# EAGLE design umodular_mega_shield_rev01 (EAGLE 7.2.0)
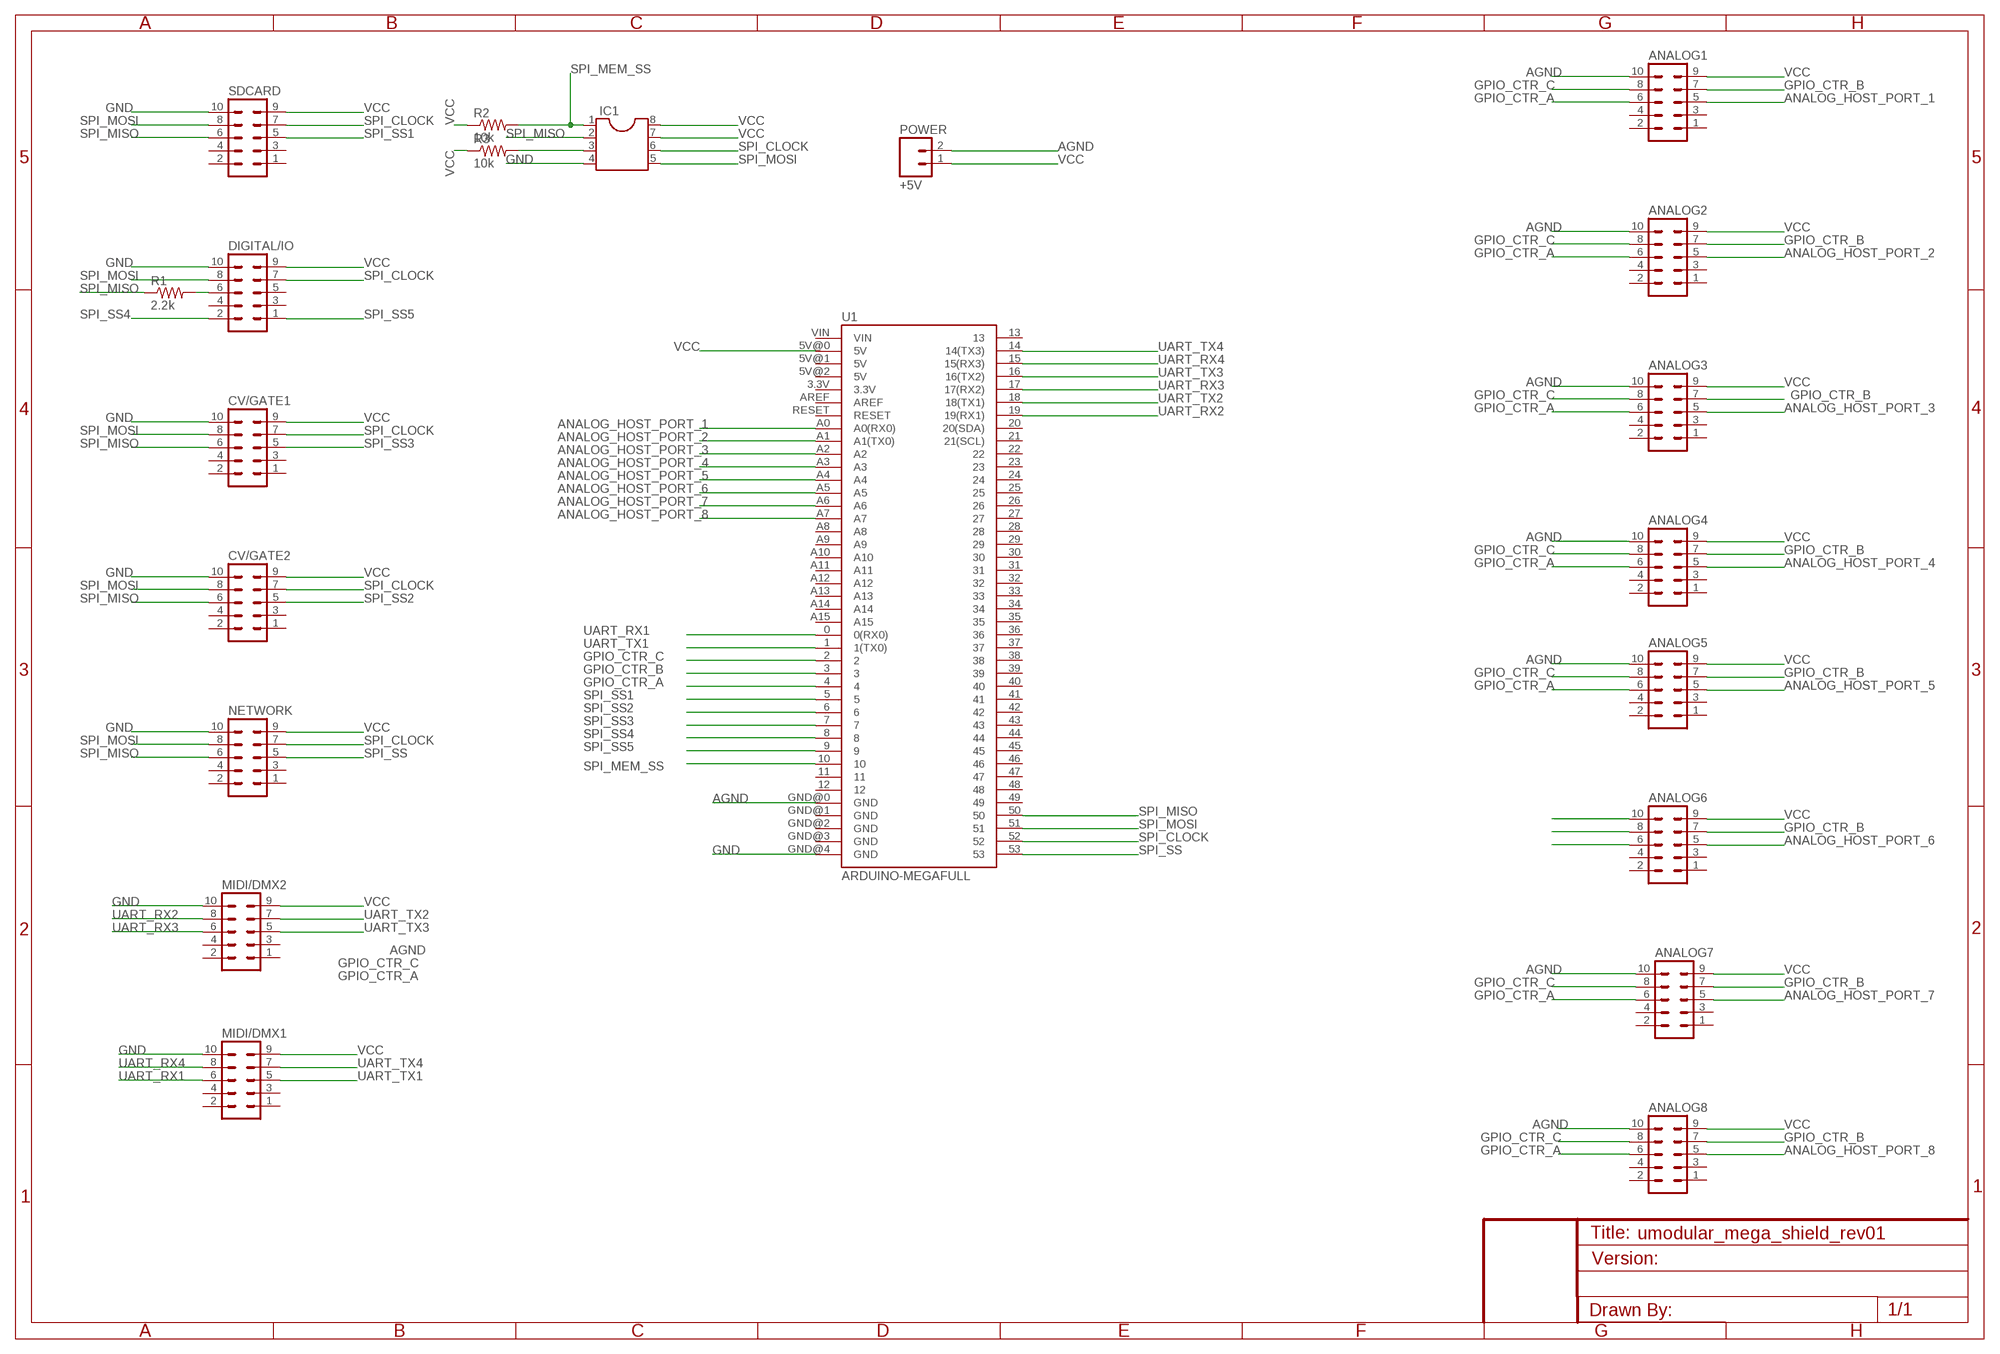
[diagram p0: schematic, sheet 1]

## Parts
ANALOG1  MA05-2  [MA05-2]
ANALOG2  MA05-2  [MA05-2]
ANALOG3  MA05-2  [MA05-2]
ANALOG4  MA05-2  [MA05-2]
ANALOG5  MA05-2  [MA05-2]
ANALOG6  MA05-2  [MA05-2]
ANALOG7  MA05-2  [MA05-2]
ANALOG8  MA05-2  [MA05-2]
CV/GATE1  MA05-2  [MA05-2]
CV/GATE2  MA05-2  [MA05-2]
DIGITAL/IO  MA05-2  [MA05-2]
IC1  DIL8  [DIL08]
MIDI/DMX1  MA05-2  [MA05-2]
MIDI/DMX2  MA05-2  [MA05-2]
NETWORK  MA05-2  [MA05-2]
POWER  +5V  M02LOCK_LONGPADS  [1X02_LOCK_LONGPADS]
R1  2.2k  R-US_0204/7  [0204/7]
R2  10k  R-US_0204/7  [0204/7]
R3  10k  R-US_0204/7  [0204/7]
SDCARD  MA05-2  [MA05-2]
U1  ARDUINO-MEGAFULL  [ARDUINO_MEGA]

## Nets
AGND: ANALOG1.10 ANALOG2.10 ANALOG3.10 ANALOG4.10 ANALOG5.10 ANALOG6.10 ANALOG7.10 ANALOG8.10 POWER.2 U1.GND@0(GND)
ANALOG_HOST_PORT_1: ANALOG1.5 U1.A0(A0(RX0))
ANALOG_HOST_PORT_2: ANALOG2.5 U1.A1(A1(TX0))
ANALOG_HOST_PORT_3: ANALOG3.5 U1.A2
ANALOG_HOST_PORT_4: ANALOG4.5 U1.A3
ANALOG_HOST_PORT_5: ANALOG5.5 U1.A4
ANALOG_HOST_PORT_6: ANALOG6.5 U1.A5
ANALOG_HOST_PORT_7: ANALOG7.5 U1.A6
ANALOG_HOST_PORT_8: ANALOG8.5 U1.A7
GND: CV/GATE1.10 CV/GATE2.10 DIGITAL/IO.10 IC1.4 MIDI/DMX1.10 MIDI/DMX2.10 NETWORK.10 SDCARD.10 U1.GND@4(GND)
GPIO_CTR_A: ANALOG1.6 ANALOG2.6 ANALOG3.6 ANALOG4.6 ANALOG5.6 ANALOG6.6 ANALOG7.6 ANALOG8.6 U1.4
GPIO_CTR_B: ANALOG1.7 ANALOG2.7 ANALOG3.7 ANALOG4.7 ANALOG5.7 ANALOG6.7 ANALOG7.7 ANALOG8.7 U1.3
GPIO_CTR_C: ANALOG1.8 ANALOG2.8 ANALOG3.8 ANALOG4.8 ANALOG5.8 ANALOG6.8 ANALOG7.8 ANALOG8.8 U1.2
N$1: DIGITAL/IO.6 R1.2
N$4: IC1.3 R3.2
SPI_CLOCK: CV/GATE1.7 CV/GATE2.7 DIGITAL/IO.7 IC1.6 NETWORK.7 SDCARD.7 U1.52
SPI_MEM_SS: IC1.1 R2.2 U1.10
SPI_MISO: CV/GATE1.6 CV/GATE2.6 IC1.2 NETWORK.6 R1.1 SDCARD.6 U1.50
SPI_MOSI: CV/GATE1.8 CV/GATE2.8 DIGITAL/IO.8 IC1.5 NETWORK.8 SDCARD.8 U1.51
SPI_SS: NETWORK.5 U1.53
SPI_SS1: SDCARD.5 U1.5
SPI_SS2: CV/GATE2.5 U1.6
SPI_SS3: CV/GATE1.5 U1.7
SPI_SS4: DIGITAL/IO.2 U1.8
SPI_SS5: DIGITAL/IO.1 U1.9
UART_RX1: MIDI/DMX1.6 U1.0(0(RX0))
UART_RX2: MIDI/DMX2.8 U1.19(19(RX1))
UART_RX3: MIDI/DMX2.6 U1.17(17(RX2))
UART_RX4: MIDI/DMX1.8 U1.15(15(RX3))
UART_TX1: MIDI/DMX1.5 U1.1(1(TX0))
UART_TX2: MIDI/DMX2.7 U1.18(18(TX1))
UART_TX3: MIDI/DMX2.5 U1.16(16(TX2))
UART_TX4: MIDI/DMX1.7 U1.14(14(TX3))
VCC: ANALOG1.9 ANALOG2.9 ANALOG3.9 ANALOG4.9 ANALOG5.9 ANALOG6.9 ANALOG7.9 ANALOG8.9 CV/GATE1.9 CV/GATE2.9 DIGITAL/IO.9 IC1.7 IC1.8 MIDI/DMX1.9 MIDI/DMX2.9 NETWORK.9 POWER.1 R2.1 R3.1 SDCARD.9 U1.5V@0(5V)
Unconnected: ANALOG1.1 ANALOG1.2 ANALOG1.3 ANALOG1.4 ANALOG2.1 ANALOG2.2 ANALOG2.3 ANALOG2.4 ANALOG3.1 ANALOG3.2 ANALOG3.3 ANALOG3.4 ANALOG4.1 ANALOG4.2 ANALOG4.3 ANALOG4.4 ANALOG5.1 ANALOG5.2 ANALOG5.3 ANALOG5.4 ANALOG6.1 ANALOG6.2 ANALOG6.3 ANALOG6.4 ANALOG7.1 ANALOG7.2 ANALOG7.3 ANALOG7.4 ANALOG8.1 ANALOG8.2 ANALOG8.3 ANALOG8.4 CV/GATE1.1 CV/GATE1.2 CV/GATE1.3 CV/GATE1.4 CV/GATE2.1 CV/GATE2.2 CV/GATE2.3 CV/GATE2.4 DIGITAL/IO.3 DIGITAL/IO.4 DIGITAL/IO.5 MIDI/DMX1.1 MIDI/DMX1.2 MIDI/DMX1.3 MIDI/DMX1.4 MIDI/DMX2.1 MIDI/DMX2.2 MIDI/DMX2.3 MIDI/DMX2.4 NETWORK.1 NETWORK.2 NETWORK.3 NETWORK.4 SDCARD.1 SDCARD.2 SDCARD.3 SDCARD.4 U1.3.3V U1.5V@1(5V) U1.5V@2(5V) U1.11 U1.12 U1.13 U1.20(20(SDA)) U1.21(21(SCL)) U1.22 U1.23 U1.24 U1.25 U1.26 U1.27 U1.28 U1.29 U1.30 U1.31 U1.32 U1.33 U1.34 U1.35 U1.36 U1.37 U1.38 U1.39 U1.40 U1.41 U1.42 U1.43 U1.44 U1.45 U1.46 U1.47 U1.48 U1.49 U1.A8 U1.A9 U1.A10 U1.A11 U1.A12 U1.A13 U1.A14 U1.A15 U1.AREF U1.GND@1(GND) U1.GND@2(GND) U1.GND@3(GND) U1.RESET U1.VIN

## Library data of the parts
ANALOG1-ANALOG8 CV/GATE1 CV/GATE2 DIGITAL/IO MIDI/DMX1 MIDI/DMX2 NETWORK SDCARD = con-lstb:MA05-2: PIN HEADER; OC_FARNELL: unknown; OC_NEWARK: unknown
IC1 = ic-package:DIL8: Dual In Line / Socket
POWER = SparkFun-Connectors:M02: Standard 2-pin 0.1" header. Use with - straight break away headers ( PRT-00116) - right angle break away headers (PRT-00553) - swiss pins (PRT-00743) - machine pins (PRT-00117) - female headers (PRT-00115) Molex polarized connector foot print use with: PRT-08233 with associated crimp pins and housings. 2.54_SCREWTERM for use with PRT-10571. 3.5mm Screw Terminal footprints for PRT-08084 5mm Screw Terminal footprints for use with PRT-08433
R1-R3 = rcl:R-US_: RESISTOR, American symbol
U1 = SparkFun-Boards:ARDUINO-MEGA: Arduino Mega board footprint

## Net classes
0 default: width 0.254 mm

## Board
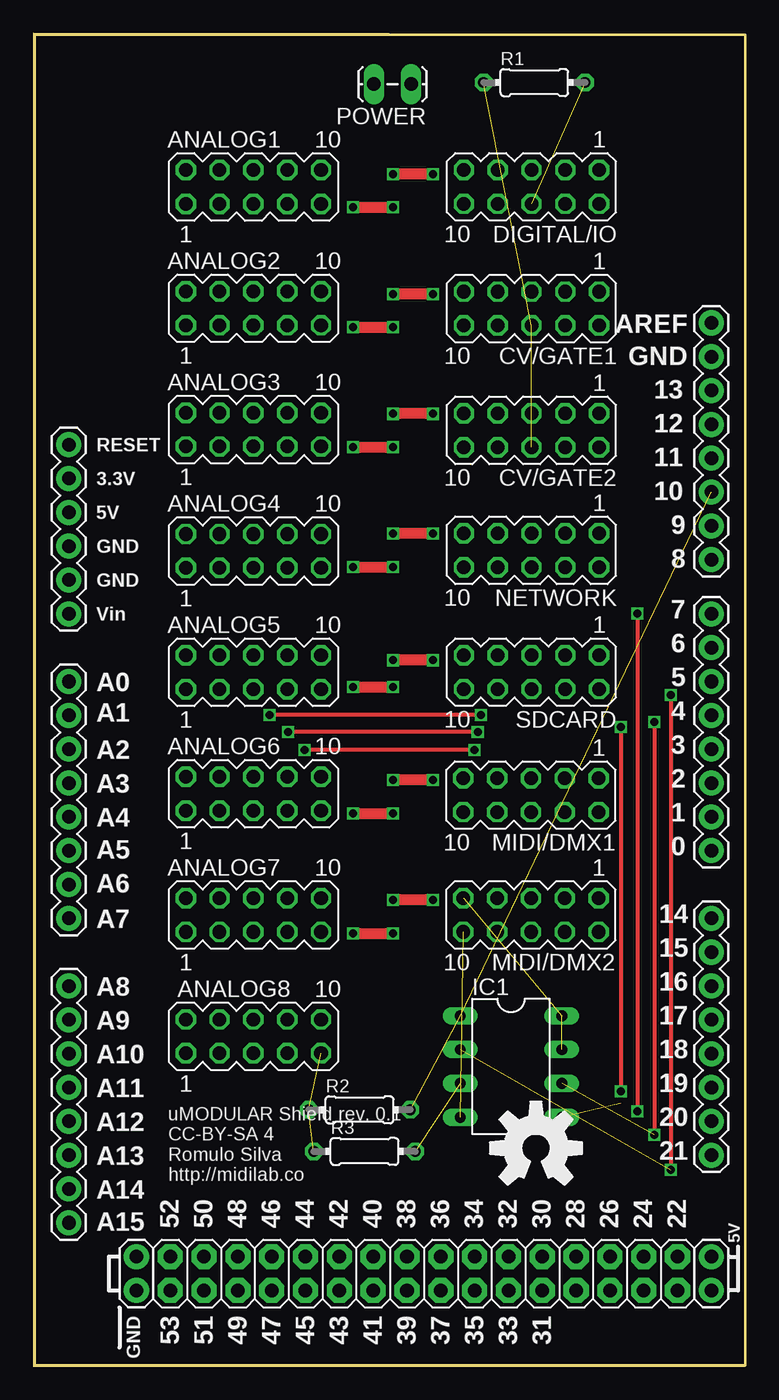
[diagram p1: board, top side]
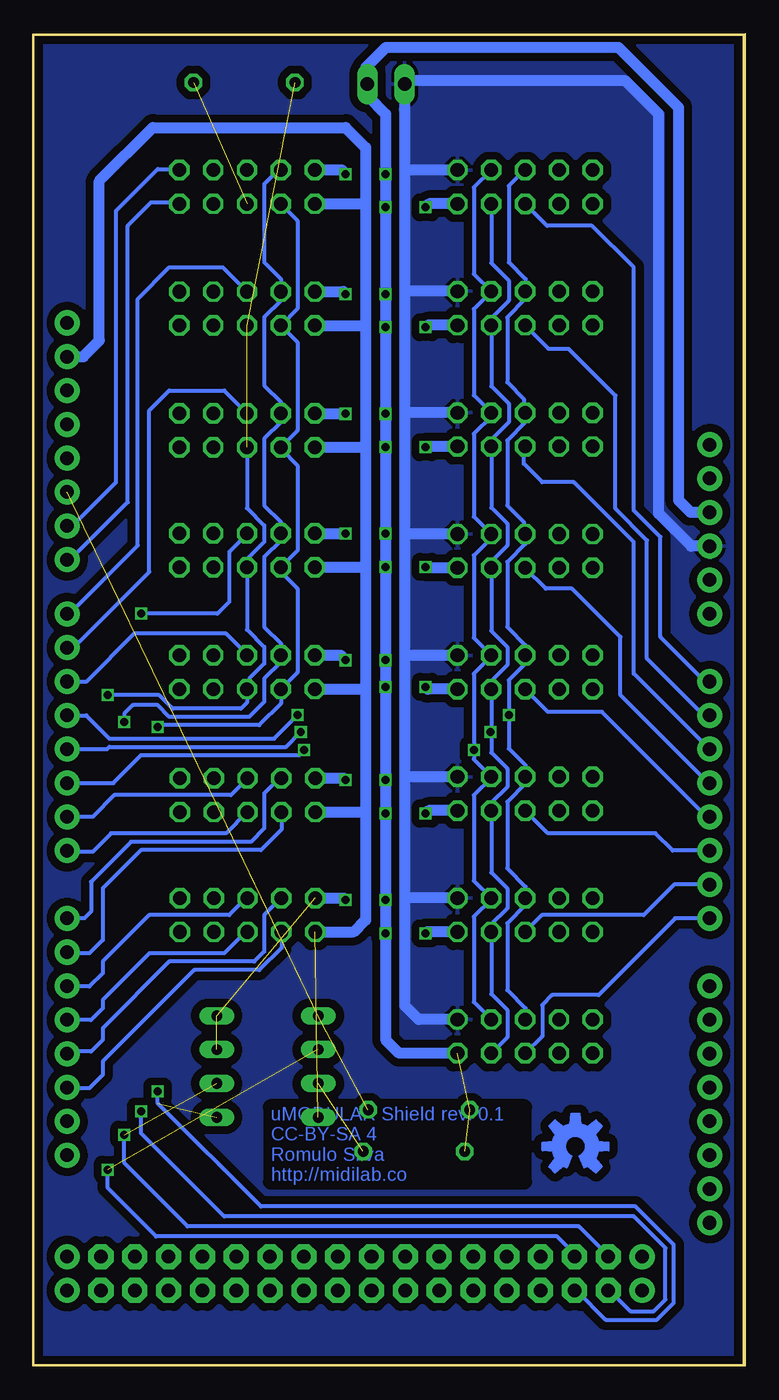
[diagram p2: board, bottom side, seen from below]

Size 53.47 x 100.07 mm. Coordinates in mm from the lower left corner, seen from the top.
Outline: 0,0 53.47,0 53.47,100 0,100.07 0,0
Copper layers (1*16): Top 0.035mm / dielectric 1.5mm / Bottom 0.035mm
Design rules "SeeedStudio_2layer_DRU_no_angle_20140221": minimum track width 6mil, minimum drill 12mil, track to track 6mil, track to pad 6mil, pad to pad 6mil, via to via 6mil, smd to smd 0mil, copper to edge 10mil, drill to drill 10mil, minimum pad ring 10mil, minimum via ring 6mil, stop-mask expansion 2mil, vias tented up to drill 100mil, thermal gap 10mil

### Footprints (pad centres in the part's own frame; a part is rotated, then mirrored left to right if it is on the bottom)
MA05-2 = drill 1.016 octagon: 1 -5.08,-1.27; 2 -5.08,1.27; 3 -2.54,-1.27; 4 -2.54,1.27; 5 0,-1.27; 6 0,1.27; 7 2.54,-1.27; 8 2.54,1.27; 9 5.08,-1.27; 10 5.08,1.27
DIL08 = drill 0.813 long: 1 -3.81,-3.81; 2 -1.27,-3.81; 3 1.27,-3.81; 4 3.81,-3.81; 5 3.81,3.81; 6 1.27,3.81; 7 -1.27,3.81; 8 -3.81,3.81
1X02_LOCK_LONGPADS = drill 1.016 long: 1 -0.127,0; 2 2.667,0
0204/7 = drill 0.813 octagon: 1 -3.81,0; 2 3.81,0
ARDUINO_MEGA = drill 1.016 pad 1.88: 0 61.42,50.8; 1 58.88,50.8; 2 56.34,50.8; 3 53.8,50.8; 3.3V 33.48,2.54; 4 51.26,50.8; 5 48.72,50.8; 5V@0 36.02,2.54; 5V@1 91.9,50.8; 5V@2 94.44,50.8; 6 46.18,50.8; 7 43.64,50.8; 8 39.576,50.8; 9 37.036,50.8; 10 34.496,50.8; 11 31.956,50.8; 12 29.416,50.8; 13 26.876,50.8; 14 66.5,50.8; 15 69.04,50.8; 16 71.58,50.8; 17 74.12,50.8; 18 76.66,50.8; 19 79.2,50.8; 20 81.74,50.8; 21 84.28,50.8; A0 48.72,2.54; A1 51.26,2.54; A2 53.8,2.54; A3 56.34,2.54; A4 58.88,2.54; A5 61.42,2.54; A6 63.96,2.54; A7 66.5,2.54; A8 71.58,2.54; A9 74.12,2.54; A10 76.66,2.54; A11 79.2,2.54; A12 81.74,2.54; A13 84.28,2.54; A14 86.82,2.54; A15 89.36,2.54; AREF 21.796,50.8; GND@0 38.56,2.54; GND@1 41.1,2.54; GND@2 91.9,7.62; GND@3 94.44,7.62; GND@4 24.336,50.8; RESET 30.94,2.54; VIN 43.64,2.54 | drill 1.016 pad 1.88 octagon: 22 91.9,48.26; 23 94.44,48.26; 24 91.9,45.72; 25 94.44,45.72; 26 91.9,43.18; 27 94.44,43.18; 28 91.9,40.64; 29 94.44,40.64; 30 91.9,38.1; 31 94.44,38.1; 32 91.9,35.56; 33 94.44,35.56; 34 91.9,33.02; 35 94.44,33.02; 36 91.9,30.48; 37 94.44,30.48; 38 91.9,27.94; 39 94.44,27.94; 40 91.9,25.4; 41 94.44,25.4; 42 91.9,22.86; 43 94.44,22.86; 44 91.9,20.32; 45 94.44,20.32; 46 91.9,17.78; 47 94.44,17.78; 48 91.9,15.24; 49 94.44,15.24; 50 91.9,12.7; 51 94.44,12.7; 52 91.9,10.16; 53 94.44,10.16

### Placement (x,y rotation side)
ANALOG1  16.53,88.53 0 top
ANALOG2  16.53,79.42 0 top
ANALOG3  16.53,70.31 0 top
ANALOG4  16.53,61.2 0 top
ANALOG5  16.53,52.09 0 top
ANALOG6  16.53,42.98 0 top
ANALOG7  16.53,33.88 0 top
ANALOG8  16.53,24.77 0 top
CV/GATE1  37.41,79.41 180 top
CV/GATE2  37.41,70.27 180 top
DIGITAL/IO  37.41,88.55 180 top
IC1  35.88,22.5 270 top
MIDI/DMX1  37.38,42.88 180 top
MIDI/DMX2  37.38,33.88 180 top
NETWORK  37.41,61.25 180 top
POWER  28.25,96.25 180 top
R1  37.62,96.38 0 top
R2  24.5,19.25 0 top
R3  24.88,16.12 0 top
SDCARD  37.41,52.11 180 top
U1  0.12,100.12 270 top
U$1  [OSHW-LOGO-M]  12.75,16.5 0 top
U$5  [OSHW-LOGO-L]  37.75,16.38 0 top

### Tracks (layer width: path | path; a pad name or v marks a point on that pad's centre or on a via)
AGND
  Bottom 0.813: U1.GND@0 4.07,61.56 6.5,64 6.5,94 9,96.5 25.33,96.5 POWER.2 25.58,90 | 25.58,90 25.58,80.5 | 25.58,80.5 25.58,71.5 | 25.58,71.5 25.58,62.5 | 25.58,62.5 25.58,53.5 | 25.58,53.5 25.58,44 | 25.58,44 25.58,35 | 25.58,35 25.58,27.08 24.54,26.04 ANALOG8.10 | ANALOG1.10 25.39,89.81 25.58,90 | ANALOG2.10 25.39,80.69 25.58,80.5 | ANALOG3.10 25.5,71.58 25.58,71.5 | ANALOG4.10 25.56,62.48 25.58,62.5 | ANALOG5.10 25.45,53.37 25.58,53.5 | ANALOG6.10 25.33,44.26 25.58,44 | ANALOG7.10 25.44,35.15 25.58,35
  pour Bottom (isolate 0.61): 0,100 53.5,100 53.5,-0.12 0,-0.12
ANALOG_HOST_PORT_1
  Bottom 0.305: U1.A0 3.03,51.41 6.38,54.75 6.38,62.25 8.38,64.25 8.38,82.5 11.5,85.62 14.89,85.62 ANALOG1.5
ANALOG_HOST_PORT_2
  Bottom 0.305: U1.A1 3.12,48.87 7.38,53.12 7.38,62 9.75,64.38 9.75,72.88 13.25,76.38 14.75,76.38 ANALOG2.5
ANALOG_HOST_PORT_3
  Bottom 0.305: U1.A2 2.7,46.33 8.38,52 8.38,61.88 12.88,66.38 15.25,66.38 16.62,67.75 16.62,68.95 ANALOG3.5
ANALOG_HOST_PORT_4
  Bottom 0.305: U1.A3 2.79,43.78 9.38,50.38 9.38,54.75 13,58.38 14.97,58.38 ANALOG4.5
ANALOG_HOST_PORT_5
  Bottom 0.305: U1.A4 2.87,41.24 10.75,49.12 14.83,49.12 ANALOG5.5
ANALOG_HOST_PORT_6
  Bottom 0.305: U1.A5 5.46,38.7 6.75,40 14.81,40 ANALOG6.5
ANALOG_HOST_PORT_7
  Bottom 0.305: U1.A6 5.33,36.16 7.62,33.88 15.26,33.88 ANALOG7.5
ANALOG_HOST_PORT_8
  Bottom 0.305: U1.A7 5.25,33.62 11,27.88 14.5,27.88 15.25,27.12 15.25,24.77 ANALOG8.5
GND  (1 unrouted)
  Bottom 0.813: U1.GND@4 49.71,75.79 48.5,77 48.5,89 44.5,93 30,93 28.5,91.5 28.5,87 | 28.5,87 28.5,78 | 28.5,78 28.5,69 | 28.5,69 28.5,60 | 28.5,60 28.5,51 | 28.5,51 28.5,41.5 | 28.5,41.5 28.5,33.5 29.39,32.6 MIDI/DMX2.10 | DIGITAL/IO.10 28.77,87.28 28.5,87 | CV/GATE1.10 28.64,78.14 28.5,78 | CV/GATE2.10 28.5,69 | NETWORK.10 28.52,59.98 28.5,60 | SDCARD.10 28.66,50.84 28.5,51 | MIDI/DMX1.10 28.61,41.6 28.5,41.5
GPIO_CTR_A  (via drill 0.6)
  Top 0.305: v33.62,48.88 v17.75,48.88
  Bottom 0.305: ANALOG1.6 16.57,89.81 17.75,88.62 17.75,82.88 16.5,81.62 16.5,80.72 ANALOG2.6 16.53,80.09 17.88,78.75 17.88,73.88 16.62,72.62 16.62,71.68 ANALOG3.6 16.53,70.84 17.88,69.5 17.88,64.62 16.62,63.38 16.62,62.57 ANALOG4.6 16.53,61.72 17.88,60.38 17.88,55.5 16.5,54.12 16.5,53.4 ANALOG5.6 16.53,52.72 17.75,51.5 17.75,48.62 | 17.75,48.62 17.75,46.38 16.5,45.12 16.5,44.28 ANALOG6.6 16.53,43.72 17.88,42.38 17.88,37.38 16.5,36 16.5,35.17 ANALOG7.6 16.53,34.59 17.88,33.25 17.88,28.25 16.5,26.88 16.5,26.07 ANALOG8.6 | U1.4 49.49,48.87 47.75,47.12 35.38,47.12 v33.62,48.88 | v17.75,48.88 18,48.88 17.75,48.62
GPIO_CTR_B  (via drill 0.6)
  Top 0.305: v33.38,47.62 v19.12,47.62
  Bottom 0.305: ANALOG1.7 19.07,82.82 17.75,81.5 17.75,80 19,78.75 19,78.22 ANALOG2.7 19.07,73.57 17.75,72.25 17.75,70.88 19.12,69.5 19.12,69.1 ANALOG3.7 19.07,64.44 17.88,63.25 17.88,61.62 19,60.5 19,60.01 ANALOG4.7 19.07,55.2 17.88,54 17.88,52.62 19,51.5 19,50.9 ANALOG5.7 19.07,47.75 | 19.07,47.75 19.07,46.07 17.88,44.88 17.88,43.5 19.12,42.25 19.12,41.77 ANALOG6.7 19.07,37.07 17.88,35.88 17.88,34.38 19.12,33.12 19.12,32.66 ANALOG7.7 19.07,27.95 17.88,26.75 17.88,24.69 ANALOG8.7 | U1.3 47.92,46.33 47.75,46.5 34.5,46.5 v33.38,47.62 | v19.12,47.62 19.2,47.62 19.07,47.75
GPIO_CTR_C  (via drill 0.6)
  Top 0.305: v33.12,46.25 v20.38,46.25
  Bottom 0.305: ANALOG1.8 20.38,88.5 20.38,82 ANALOG2.8 20.38,79.38 20.38,72.89 ANALOG3.8 19.07,71.31 20.38,70 20.38,63.78 ANALOG4.8 19.07,62.18 20.38,60.88 20.38,54.67 ANALOG5.8 19.07,53.3 20.38,52 20.38,46.12 | 20.38,46.12 20.38,45.56 ANALOG6.8 19.07,44.18 20.38,42.88 20.38,36.45 ANALOG7.8 19.07,35.05 20.38,33.75 20.38,27.34 ANALOG8.8 | U1.2 47.47,43.78 45.38,45.88 33.5,45.88 v33.12,46.25 | v20.38,46.25 20.5,46.25 20.38,46.12
N$1  (1 unrouted)
N$4  (1 unrouted)
SPI_CLOCK  (via drill 0.6)  (1 unrouted)
  Top 0.305: v46.62,48.38 v46.62,17.38
  Bottom 0.305: DIGITAL/IO.7 35.06,89.81 36.12,88.75 36.12,82.88 34.88,81.62 CV/GATE1.7 34.88,80 36.12,78.75 36.12,73.62 34.88,72.38 CV/GATE2.7 34.88,70.88 36.12,69.62 36.12,64.62 34.88,63.38 NETWORK.7 34.88,62 36.12,60.75 36.12,55.5 34.88,54.25 SDCARD.7 34.88,52.88 36.12,51.62 36.12,49.88 37.25,48.75 43.25,48.75 44.12,49.62 46,49.62 46.62,49 v46.62,48.38 | U1.52 10.29,8.29 12.5,10.5 41.88,10.5 46.62,15.25 v46.62,17.38
SPI_MEM_SS  (2 unrouted)
SPI_MISO  (via drill 0.6)  (3 unrouted)
  Top 0.305: v47.88,50.38 v47.88,14.75
  Bottom 0.305: CV/GATE2.6 37.41,64.42 36.12,63.12 36.12,61.88 37.38,60.62 37.38,60.02 NETWORK.6 37.41,55.29 36.12,54 36.12,52.75 37.25,51.62 37.25,51.01 SDCARD.6 37.41,49.84 37.88,49.38 43,49.38 44,50.38 v47.88,50.38 | U1.50 12.82,8.45 14.12,9.75 44.25,9.75 47.88,13.38 v47.88,14.75
SPI_MOSI  (via drill 0.6)  (1 unrouted)
  Top 0.305: v44.12,48 v44.12,20.62
  Bottom 0.305: DIGITAL/IO.8 34.88,87.25 33.62,86 33.62,79.39 CV/GATE1.8 34.88,78.12 33.62,76.88 33.62,70.25 CV/GATE2.8 34.88,68.88 33.62,67.62 33.62,61.23 NETWORK.8 34.88,59.62 33.62,58.38 33.62,52.09 SDCARD.8 34.88,49.75 36.5,48.12 43.88,48.12 v44.12,48 | U1.51 12.69,5.68 10.5,3.5 6.62,3.5 5.38,4.75 5.38,9.12 8.25,12 36.38,12 44.12,19.75 v44.12,20.62
SPI_SS  (via drill 0.6)
  Top 0.305: v45.38,56.5 v45.38,19.12
  Bottom 0.305: NETWORK.5 37.48,62.52 37.48,62.4 38.75,61.12 38.75,57.38 39.62,56.5 v45.38,56.5 | U1.53 10.19,5.68 8.62,4.12 6.88,4.12 6,5 6,8.88 8.38,11.25 39.12,11.25 45.38,17.5 v45.38,19.12
SPI_SS1
  Bottom 0.305: SDCARD.5 37.41,53.41 39,55 45.88,55 49.5,51.38 50.9,51.38 U1.5
SPI_SS2
  Bottom 0.305: U1.6 50.43,53.95 44.75,59.62 44.75,71.75 43.25,73.25 39.13,73.25 CV/GATE2.5
SPI_SS3
  Bottom 0.305: U1.7 50.77,56.48 45.62,61.62 45.62,80.12 43.25,82.5 39.24,82.5 CV/GATE1.5
SPI_SS4
  Bottom 0.305: U1.8 50.7,60.55 46.38,64.88 46.38,85.62 44.62,87.38 42.59,87.38 DIGITAL/IO.2
SPI_SS5
  Bottom 0.305: U1.9 50.54,63.09 47.25,66.38 47.25,86.75 44.12,89.88 42.55,89.88 DIGITAL/IO.1
UART_RX1
  Bottom 0.305: MIDI/DMX1.6 37.4,41.6 39,40 47.62,40 49,38.62 50.84,38.62 U1.0
UART_RX2
  Bottom 0.305: MIDI/DMX2.8 34.84,31.41 36.5,29.75 41.38,29.75 48.25,22.88 48.25,21.88 49.25,20.88 50.88,20.88 U1.19
UART_RX3
  Bottom 0.305: MIDI/DMX2.6 37.52,32.6 39.12,31 44.75,31 48.25,27.5 48.25,26.88 49.12,26 U1.17
UART_RX4
  Bottom 0.305: MIDI/DMX1.8 34.84,40.29 36.38,38.75 45.38,38.75 48.25,35.88 48.25,32 49.25,31 50.84,31 U1.15
UART_TX1
  Bottom 0.305: MIDI/DMX1.5 37.38,44.12 38.62,42.88 47.38,42.88 49,41.25 U1.1
UART_TX2
  Bottom 0.305: MIDI/DMX2.7 34.85,35.15 36.12,33.88 36.12,31.12 36.88,30.38 43.25,30.38 48.25,25.38 48.25,24.5 49.12,23.62 50.77,23.62 U1.18
UART_TX3
  Bottom 0.305: MIDI/DMX2.5 37.48,35.15 38.75,33.88 44.75,33.88 48.25,30.38 48.25,29.5 49.25,28.5 50.88,28.5 U1.16
UART_TX4
  Bottom 0.305: MIDI/DMX1.7 34.98,44.15 36.12,43 36.12,40.38 37.12,39.38 46.12,39.38 49.12,36.38 49.12,34.12 49.62,33.62 U1.14
VCC  (via drill 0.6)  (4 unrouted)
  Top 0.813: v30,89.5 v27,89.5 | v24,87 v27,87 | v24,78 v27,78 | v30,71.5 v27,71.5 | v24,69 v27,69 | v30,62.5 v27,62.5 | v24,60 v27,60 | v30,53 v27,53 | v30,80.5 v27,80.5 | v24,51 v27,51 | v30,44 v27,44 | v24,41.5 v27,41.5 | v24,32.5 v27,32.5 | v30,35 v27,35
  Bottom 0.813: U1.5V@0 4.11,64.11 5,65 5,94.5 9.5,99 27,99 28.5,97.5 28.5,96.37 POWER.1 28.38,95.38 27,94 v27,89.5 v27,87 v27,80.5 v27,78 v27,71.5 v27,69 v27,62.5 v27,60 v27,53 v27,51 v27,44 v27,41.5 v27,35 v27,32.5 27,24.5 26,23.5 ANALOG8.9 | DIGITAL/IO.9 30.32,89.81 v30,89.5 | CV/GATE2.9 30.04,71.53 v30,71.5 | NETWORK.9 30.02,62.52 v30,62.5 | SDCARD.9 30.38,53.38 v30,53 | MIDI/DMX1.9 30.14,44.15 v30,44 | ANALOG3.9 23.95,69.05 v24,69 | ANALOG4.9 23.93,59.94 v24,60 | ANALOG2.9 23.84,78.16 v24,78 | ANALOG1.9 23.73,87.27 v24,87 | CV/GATE1.9 30.18,80.67 v30,80.5 | ANALOG5.9 23.82,50.83 v24,51 | ANALOG6.9 23.79,41.72 v24,41.5 | ANALOG7.9 23.89,32.6 v24,32.5 | MIDI/DMX2.9 30.14,35.15 v30,35

### Text on the board
Bottom: uMODULAR Shield rev. 0.1 / CC-BY-SA 4 / Romulo Silva / http://midilab.co
tNames: uMODULAR Shield rev. 0.1 / CC-BY-SA 4 / Romulo Silva / http://midilab.co